# EAGLE design main (EAGLE 6.4)
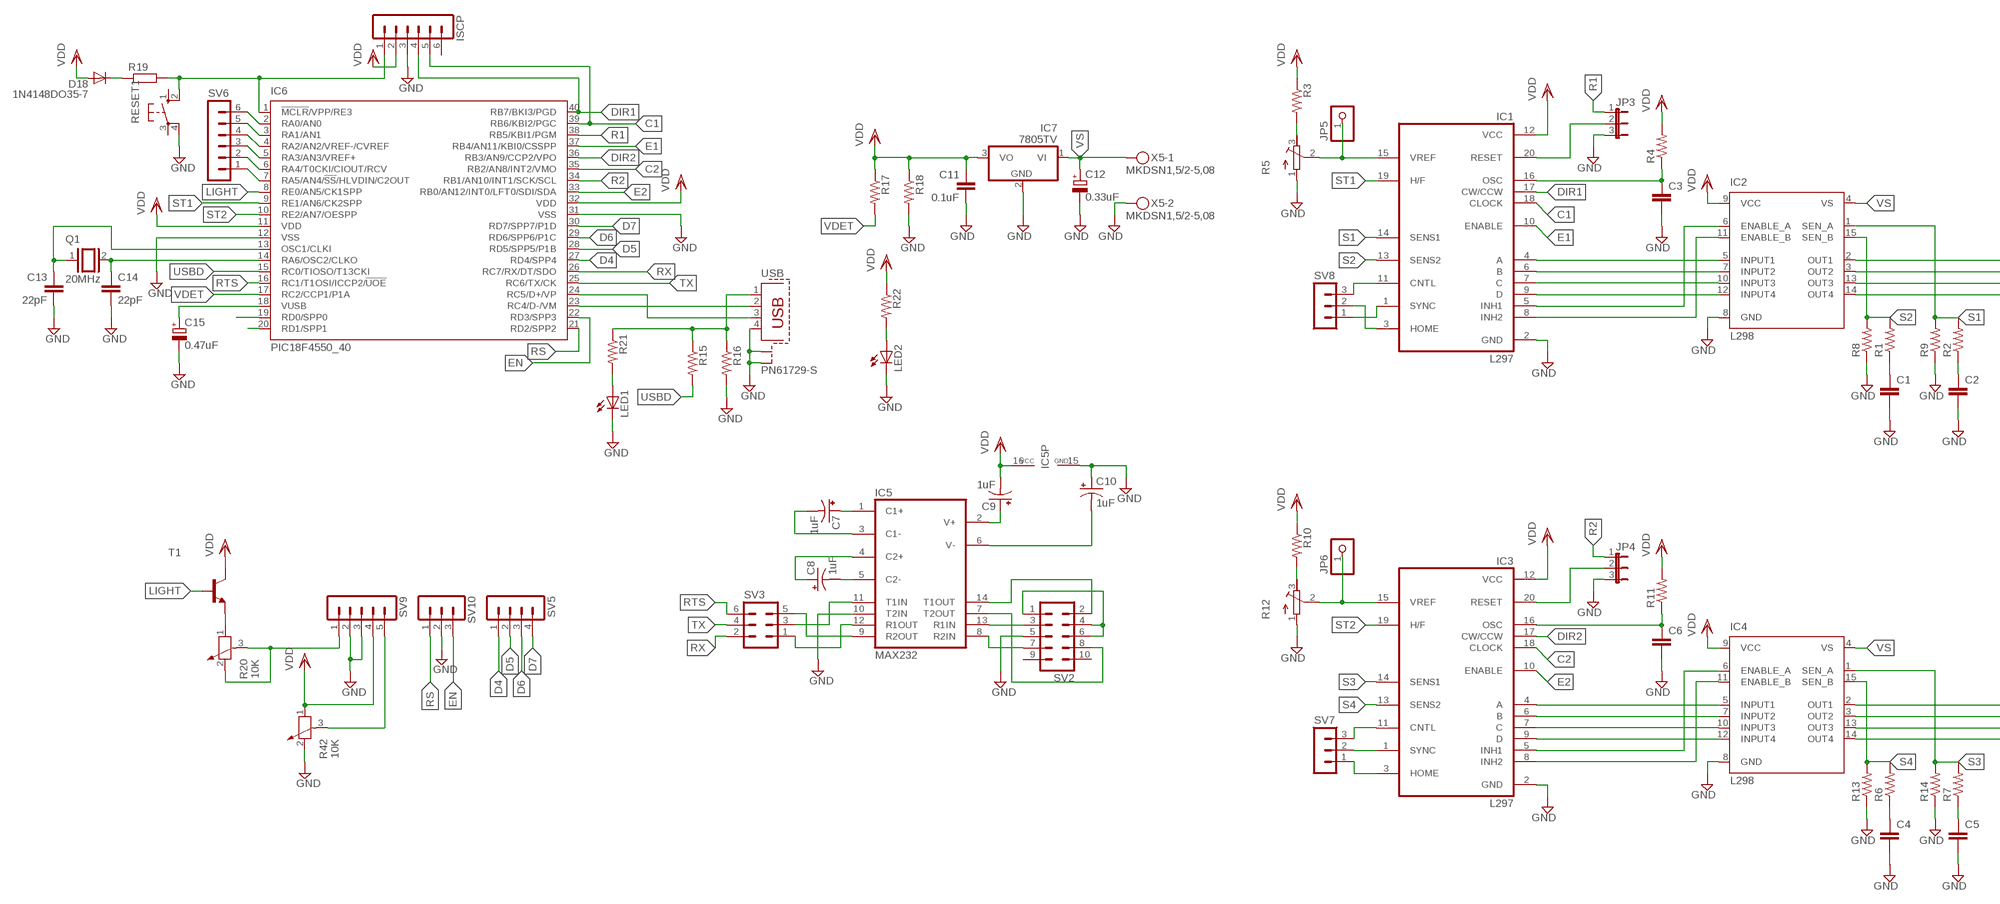
[diagram p0: schematic, sheet 1, part 1 of 2]
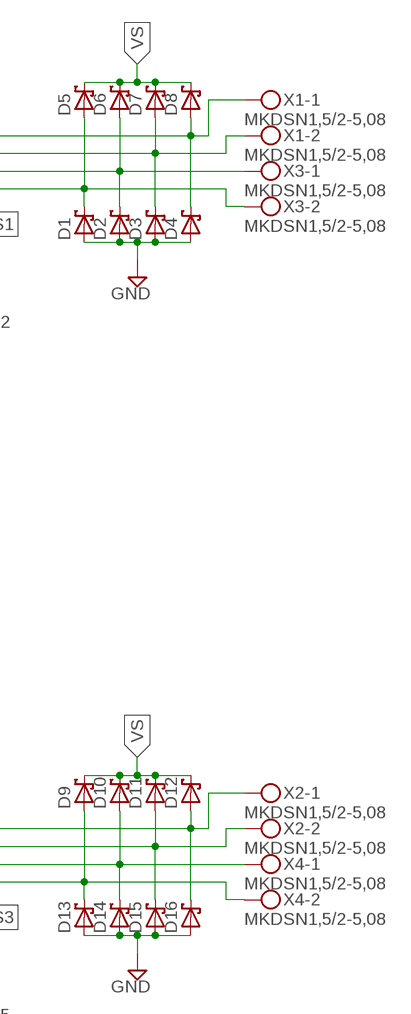
[diagram p1: schematic, sheet 1, part 2 of 2]

## Parts
C1  C2.5/2  [C2.5-2]
C2  C2.5/2  [C2.5-2]
C3  C2.5/2  [C2.5-2]
C4  C2.5/2  [C2.5-2]
C5  C2.5/2  [C2.5-2]
C6  C2.5/2  [C2.5-2]
C7  1uF  CPOL-USE2.5-6  [E2,5-6]
C8  1uF  CPOL-USE2.5-6  [E2,5-6]
C9  1uF  CPOL-USE2.5-6  [E2,5-6]
C10  1uF  CPOL-USE2.5-6  [E2,5-6]
C11  0.1uF  C-EU025-025X050  [C025-025X050]
C12  0.33uF  CPOL-EUE2.5-6  [E2,5-6]
C13  22pF  C-EU025-024X044  [C025-024X044]
C14  22pF  C-EU025-024X044  [C025-024X044]
C15  0.47uF  CPOL-EUE2.5-6  [E2,5-6]
D1  SCHOTTKY-DIODEDO201T15  [DO201T15]
D2  SCHOTTKY-DIODEDO201T15  [DO201T15]
D3  SCHOTTKY-DIODEDO201T15  [DO201T15]
D4  SCHOTTKY-DIODEDO201T15  [DO201T15]
D5  SCHOTTKY-DIODEDO201T15  [DO201T15]
D6  SCHOTTKY-DIODEDO201T15  [DO201T15]
D7  SCHOTTKY-DIODEDO201T15  [DO201T15]
D8  SCHOTTKY-DIODEDO201T15  [DO201T15]
D9  SCHOTTKY-DIODEDO201T15  [DO201T15]
D10  SCHOTTKY-DIODEDO201T15  [DO201T15]
D11  SCHOTTKY-DIODEDO201T15  [DO201T15]
D12  SCHOTTKY-DIODEDO201T15  [DO201T15]
D13  SCHOTTKY-DIODEDO201T15  [DO201T15]
D14  SCHOTTKY-DIODEDO201T15  [DO201T15]
D15  SCHOTTKY-DIODEDO201T15  [DO201T15]
D16  SCHOTTKY-DIODEDO201T15  [DO201T15]
D18  1N4148DO35-7  [DO35-7]
IC1  L297  [DIL20]
IC2  L298  [MULTIWATT-15]
IC3  L297  [DIL20]
IC4  L298  [MULTIWATT-15]
IC5  MAX232  [DIL16]
IC6  PIC18F4550_40  [DIL40]
IC7  7805TV  [TO220V]
ISCP  MA06-1  [MA06-1]
JP3  JP2E  [JP2]
JP4  JP2E  [JP2]
JP5  PINHD-1X1  [1X01]
JP6  PINHD-1X1  [1X01]
LED1  LED5MM  [LED5MM]
LED2  LED5MM  [LED5MM]
Q1  20MHz  XTAL/S  [QS]
R1  R-US_0204/7  [0204/7]
R2  R-US_0204/7  [0204/7]
R3  R-US_0204/7  [0204/7]
R4  R-US_0204/7  [0204/7]
R5  R-TRIMM64Y  [RTRIM64Y]
R6  R-US_0204/7  [0204/7]
R7  R-US_0204/7  [0204/7]
R8  R-US_0411/15  [0411/15]
R9  R-US_0411/15  [0411/15]
R10  R-US_0204/7  [0204/7]
R11  R-US_0204/7  [0204/7]
R12  R-TRIMM64Y  [RTRIM64Y]
R13  R-US_0411/15  [0411/15]
R14  R-US_0411/15  [0411/15]
R15  R-US_0204/7  [0204/7]
R16  R-US_0204/7  [0204/7]
R17  R-US_0204/7  [0204/7]
R18  R-US_0204/7  [0204/7]
R19  R-EU_0204/7  [0204/7]
R20  10K  POTENTIOMETER_PT-10  [PT-10]
R21  R-US_0204/7  [0204/7]
R22  R-US_0204/7  [0204/7]
R42  10K  POTENTIOMETER_PT-10  [PT-10]
RESET1  10-XX  [B3F-10XX]
SV2  MA05-2  [MA05-2]
SV3  MA03-2  [MA03-2]
SV5  MA04-1  [MA04-1]
SV6  MA06-1  [MA06-1]
SV7  MA03-1  [MA03-1]
SV8  MA03-1  [MA03-1]
SV9  MA05-1  [MA05-1]
SV10  MA03-1  [MA03-1]
T1  BC548-NPN-TO92-CBE  [TO92-CBE]
USB  PN61729-S  [PN61729-S]
X1  MKDSN1,5/2-5,08  [MKDSN1,5/2-5,08]
X2  MKDSN1,5/2-5,08  [MKDSN1,5/2-5,08]
X3  MKDSN1,5/2-5,08  [MKDSN1,5/2-5,08]
X4  MKDSN1,5/2-5,08  [MKDSN1,5/2-5,08]
X5  MKDSN1,5/2-5,08  [MKDSN1,5/2-5,08]

## Nets
C1: IC1.18(CLOCK) IC6.39(RB6/KBI2/PGC) ISCP.5
C2: IC3.18(CLOCK) IC6.35(RB2/AN8/INT2/VMO)
D4: IC6.27(RD4/SPP4) SV5.1
D5: IC6.28(RD5/SPP5/P1B) SV5.2
D6: IC6.29(RD6/SPP6/P1C) SV5.3
D7: IC6.30(RD7/SPP7/P1D) SV5.4
DIR1: IC1.17(CW/CCW) IC6.40(RB7/BKI3/PGD) ISCP.4
DIR2: IC3.17(CW/CCW) IC6.36(RB3/AN9/CCP2/VPO)
E1: IC1.10(ENABLE) IC6.37(RB4/AN11/KBI0/CSSPP)
E2: IC3.10(ENABLE) IC6.33(RB0/AN12/INT0/LFT0/SDI/SDA)
EN: IC6.22(RD3/SPP3) SV10.3
GND: C1.2 C2.2 C3.2 C4.2 C5.2 C6.2 C10.+ C11.2 C12.- C13.2 C14.2 C15.- D1.A D2.A D3.A D4.A D13.A D14.A D15.A D16.A IC1.2(GND) IC2.8(GND) IC3.2(GND) IC4.8(GND) IC5.10(T2IN) IC5.15(GND) IC6.12(VSS) IC6.31(VSS) IC7.2(GND) ISCP.3 JP3.3 JP4.3 LED1.K(C) LED2.K(C) R5.1(E) R8.1 R9.1 R12.1(E) R13.1 R14.1 R16.2 R18.2 R42.2 RESET1.4(P1) SV2.5 SV9.2 SV9.3 SV10.2 USB.4 USB.S1 USB.S2 X5.2
LIGHT: IC6.8(RE0/AN5/CK1SPP) T1.B
N$1: IC1.4(A) IC2.5(INPUT1)
N$2: IC1.8(INH2) IC2.11(ENABLE_B)
N$3: IC1.9(D) IC2.12(INPUT4)
N$4: IC1.7(C) IC2.10(INPUT3)
N$5: IC1.6(B) IC2.7(INPUT2)
N$6: IC1.5(INH1) IC2.6(ENABLE_A)
N$7: C1.1 R1.1
N$8: C2.1 R2.1
N$9: IC3.9(D) IC4.12(INPUT4)
N$10: IC3.7(C) IC4.10(INPUT3)
N$11: D4.C D8.A IC2.2(OUT1) X1.1
N$12: D3.C D7.A IC2.3(OUT2) X1.2
N$13: D2.C D6.A IC2.13(OUT3) X3.1
N$14: D1.C D5.A IC2.14(OUT4) X3.2
N$15: R3.2 R5.3(A)
N$16: IC5.11(T1IN) SV3.3
N$17: C3.1 IC1.16(OSC) R4.1
N$18: IC3.6(B) IC4.7(INPUT2)
N$19: IC3.4(A) IC4.5(INPUT1)
N$20: IC3.8(INH2) IC4.11(ENABLE_B)
N$21: IC3.5(INH1) IC4.6(ENABLE_A)
N$22: C4.1 R6.1
N$23: C5.1 R7.1
N$24: D12.A D16.C IC4.2(OUT1) X2.1
N$25: D11.A D15.C IC4.3(OUT2) X2.2
N$26: D10.A D14.C IC4.13(OUT3) X4.1
N$27: D9.A D13.C IC4.14(OUT4) X4.2
N$28: R10.2 R12.3(A)
N$29: IC3.15(VREF) JP6.1 R12.2(S)
N$30: C6.1 IC3.16(OSC) R11.1
N$31: IC5.13(R1IN) SV2.3
N$32: IC3.11(CNTL) SV7.3
N$33: IC5.9(R2OUT) SV3.5
N$34: IC5.12(R1OUT) SV3.1
N$35: R15.1 R16.1 R21.1 USB.1
N$36: C13.1 IC6.13(OSC1/CLKI) Q1.1
N$37: C14.1 IC6.14(RA6/OSC2/CLKO) Q1.2
N$38: IC1.20(RESET) JP3.2
N$39: IC6.1(!MCLR!/VPP/RE3) ISCP.1 R19.2 RESET1.2(S1)
N$40: D18.C R19.1
N$41: IC3.20(RESET) JP4.2
N$42: IC6.19(RD0/SPP0)
N$43: IC6.20(RD1/SPP1)
N$44: IC3.1(SYNC) SV7.2
N$45: IC3.3(HOME) SV7.1
N$46: IC1.11(CNTL) SV8.3
N$47: IC1.3(HOME) SV8.2
N$48: IC1.1(SYNC) SV8.1
N$49: IC6.2(RA0/AN0) SV6.6
N$50: R20.1 T1.E
N$51: IC6.3(RA1/AN1) SV6.5
N$52: SV2.1 SV2.4 SV2.6
N$53: R20.2 R20.3 SV9.1
N$54: IC5.14(T1OUT) SV2.2
N$55: IC5.7(T2OUT) SV2.8
N$56: IC5.8(R2IN) SV2.7
N$57: IC6.4(RA2/AN2/VREF-/CVREF) SV6.4
N$58: IC6.5(RA3/AN3/VREF+) SV6.3
N$59: IC6.6(RA4/T0CKI/CIOUT/RCV) SV6.2
N$60: IC6.7(RA5/AN4/!SS!/HLVDIN/C2OUT) SV6.1
N$61: LED1.A R21.2
N$62: LED2.A R22.2
N$68: C15.+ IC6.18(VUSB)
N$69: IC6.23(RC4/D-/VM) USB.2
N$70: IC6.24(RC5/D+/VP) USB.3
N$95: C8.- IC5.5(C2-)
N$100: IC1.15(VREF) JP5.1 R5.2(S)
N$104: C8.+ IC5.4(C2+)
N$105: C7.+ IC5.1(C1+)
N$106: C7.- IC5.3(C1-)
N$110: C9.+ IC5.2(V+)
N$111: C10.- IC5.6(V-)
N$127: R42.3 SV9.5
R1: IC6.38(RB5/KBI1/PGM) JP3.1
R2: IC6.34(RB1/AN10/INT1/SCK/SCL) JP4.1
RS: IC6.21(RD2/SPP2) SV10.1
RTS: IC6.16(RC1/T1OSI/ICCP2/!UOE) SV3.6
RX: IC6.26(RC7/RX/DT/SDO) SV3.2
S1: IC1.14(SENS1) IC2.1(SEN_A) R2.2 R9.2
S2: IC1.13(SENS2) IC2.15(SEN_B) R1.2 R8.2
S3: IC3.14(SENS1) IC4.1(SEN_A) R7.2 R14.2
S4: IC3.13(SENS2) IC4.15(SEN_B) R6.2 R13.2
ST1: IC1.19(H/F) IC6.9(RE1/AN6/CK2SPP)
ST2: IC3.19(H/F) IC6.10(RE2/AN7/OESPP)
TX: IC6.25(RC6/TX/CK) SV3.4
USBD: IC6.15(RC0/TIOSO/T13CKI) R15.2
VDD: C9.- C11.1 D18.A IC1.12(VCC) IC2.9(VCC) IC3.12(VCC) IC4.9(VCC) IC5.16(VCC) IC6.11(VDD) IC6.32(VDD) IC7.3(VO) ISCP.2 R3.1 R4.2 R10.1 R11.2 R17.1 R18.1 R22.1 R42.1 SV9.4 T1.C
VDET: IC6.17(RC2/CCP1/P1A) R17.2
VS: C12.+ D5.C D6.C D7.C D8.C D9.C D10.C D11.C D12.C IC2.4(VS) IC4.4(VS) IC7.1(VI) X5.1
Unconnected: ISCP.6 RESET1.1(S) RESET1.3(P) SV2.9 SV2.10

## Library data of the parts
C1-C6 = capacitor-wima:C: CAPACITOR naming: grid - package width
C7-C10 = rcl:CPOL-US: POLARIZED CAPACITOR, American symbol
C11 C13 C14 = rcl:C-EU: CAPACITOR, European symbol
C12 C15 = rcl:CPOL-EU: POLARIZED CAPACITOR, European symbol
D1-D16 = diode:SCHOTTKY-DIODE: Schottky Diode
D18 = diode:1N4148: DIODE high speed (Philips)
IC1 IC3 = st-microelectronics:L297: STEPPER MOTOR CONTROLLER; MPN: L297/1; OC_FARNELL: 1094209; OC_NEWARK: 56P8258
IC2 IC4 = st-microelectronics:L298: DUAL FULL-BRIDGE DRIVER; MPN: L298N; OC_FARNELL: 1589425; OC_NEWARK: 32M1527
IC5 = maxim:MAX232: RS232 TRANSEIVER; MF: MAXIM; MPN: MAX232ACPE+; OC_FARNELL: 9723773; OC_NEWARK: 68K4544
IC6 = microchip:PIC18F4*_40: USB Microcontrollers with nanoWatt Technology High-Performance, Enhanced Flash, 28/40/44-Pin, Source: http://ww1.microchip.com/downloads/en/devicedoc/39632c.pdf; MF: MICROCHIP; MPN: PIC18F4550-I/P; OC_FARNELL: 9321357; OC_NEWARK: 74K8623
IC7 = linear:78*: Positive VOLTAGE REGULATOR Source: http://cache.national.com/ds/LM/LM78L05.pdf http://www.fairchildsemi.com/ds/LM/LM7805.pdf
ISCP SV6 = con-lstb:MA06-1: PIN HEADER; OC_FARNELL: unknown; OC_NEWARK: unknown
JP3 JP4 = jumper:JP2E: JUMPER
JP5 JP6 = pinhead:PINHD-1X1: PIN HEADER
LED1 LED2 = led:LED: LED OSRAM: - CHIPLED LG R971, LG N971, LY N971, LG Q971, LY Q971, LO R971, LY R971 LH N974, LH R974 LS Q976, LO Q976, LY Q976 LO Q996 - Hyper CHIPLED LW Q18S LB Q993, LB Q99A, LB R99A - SideLED LS A670, LO A670, LY A670, LG A670, LP A670 LB A673, LV A673, LT A673, LW A673 LH A674 LY A675 LS A676, LA A676, LO A676, LY A676, LW A676 LS A679, LY A679, LG A679 - Hyper Micro SIDELED® LS Y876, LA Y876, LO Y876, LY Y876 LT Y87S - SmartLED LW L88C, LW L88S LB L89C, LB L89S, LG L890 LS L89K, LO L89K, LY L89K LS L896, LA L896, LO L896, LY L896 - TOPLED LS T670, LO T670, LY T670, LG T670, LP T670 LSG T670, LSP T670, LSY T670, LOP T670, LYG T670 LG T671, LOG T671, LSG T671 LB T673, LV T673, LT T673, LW T673 LH T674 LS T676, LA T676, LO T676, LY T676, LB T676, LH T676, LSB T676, LW T676 LB T67C, LV T67C, LT T67C, LS T67K, LO T67K, LY T67K, LW E67C LS E67B, LA E67B, LO E67B, LY E67B, LB E67C, LV E67C, LT E67C LW T67C LS T679, LY T679, LG T679 LS T770, LO T770, LY T770, LG T770, LP T770 LB T773, LV T773, LT T773, LW T773 LH T774 LS E675, LA E675, LY E675, LS T675 LS T776, LA T776, LO T776, LY T776, LB T776 LHGB T686 LT T68C, LB T68C - Hyper Mini TOPLED® LB M676 - Mini TOPLED Santana® LG M470 LS M47K, LO M47K, LY M47K Source: http://www.osram.convergy.de LUXEON: - LUMILED® LXK2-PW12-R00, LXK2-PW12-S00, LXK2-PW14-U00, LXK2-PW14-V00 LXK2-PM12-R00, LXK2-PM12-S00, LXK2-PM14-U00 LXK2-PE12-Q00, LXK2-PE12-R00, LXK2-PE12-S00, LXK2-PE14-T00, LXK2-PE14-U00 LXK2-PB12-K00, LXK2-PB12-L00, LXK2-PB12-M00, LXK2-PB14-N00, LXK2-PB14-P00, LXK2-PB14-Q00 LXK2-PR12-L00, LXK2-PR12-M00, LXK2-PR14-Q00, LXK2-PR14-R00 LXK2-PD12-Q00, LXK2-PD12-R00, LXK2-PD12-S00 LXK2-PH12-R00, LXK2-PH12-S00 LXK2-PL12-P00, LXK2-PL12-Q00, LXK2-PL12-R00 Source: www.luxeon.com KINGBRIGHT: KA-3528ASYC Source: www.kingbright.com
Q1 = special:XTAL/S: CRYSTAL
R1-R4 R6-R11 R13-R18 R21 R22 = resistor:R-US_: RESISTOR, American symbol
R5 R12 = resistor:R-TRIMM: Trimm resistor
R19 = rcl:R-EU_: RESISTOR, European symbol
R20 R42 = rcl:POTENTIOMETER_: Potentiometer
RESET1 = switch-omron:10-XX: OMRON SWITCH; MPN: B3F-1000; OC_FARNELL: 176432; OC_NEWARK: 36M3542
SV2 = con-lstb:MA05-2: PIN HEADER; OC_FARNELL: unknown; OC_NEWARK: unknown
SV3 = con-lstb:MA03-2: PIN HEADER; OC_FARNELL: unknown; OC_NEWARK: unknown
SV5 = con-lstb:MA04-1: PIN HEADER; OC_FARNELL: unknown; OC_NEWARK: unknown
SV7 SV8 SV10 = con-lstb:MA03-1: PIN HEADER; OC_FARNELL: unknown; OC_NEWARK: unknown
SV9 = con-lstb:MA05-1: PIN HEADER; OC_FARNELL: unknown; OC_NEWARK: unknown
T1 = transistor:*-NPN-: NPN Transistror BF959 corrected 2008.03.06
USB = con-berg:PN61729-S: BERG USB connector; OC_FARNELL: unknown; OC_NEWARK: unknown
X1-X5 = con-phoenix-508:MKDSN1,5/2-5,08: MKDSN 1,5/ 2-5,08 Printklemme Nennstrom: 13,5 A Nennspannung: 250 V Rastermaß: 5,08 mm Polzahl: 2 Anschlussart: Schraubanschluss Montage: Löten Anschlussrichtung Leiter/Platine: 0 ° Artikelnummer: 1729128 Source: http://eshop.phoenixcontact.com .. 1729128.pdf; MPN: MKDSN 1,5/2-5.08; OC_FARNELL: 1792903; OC_NEWARK: 30M2397

## Board
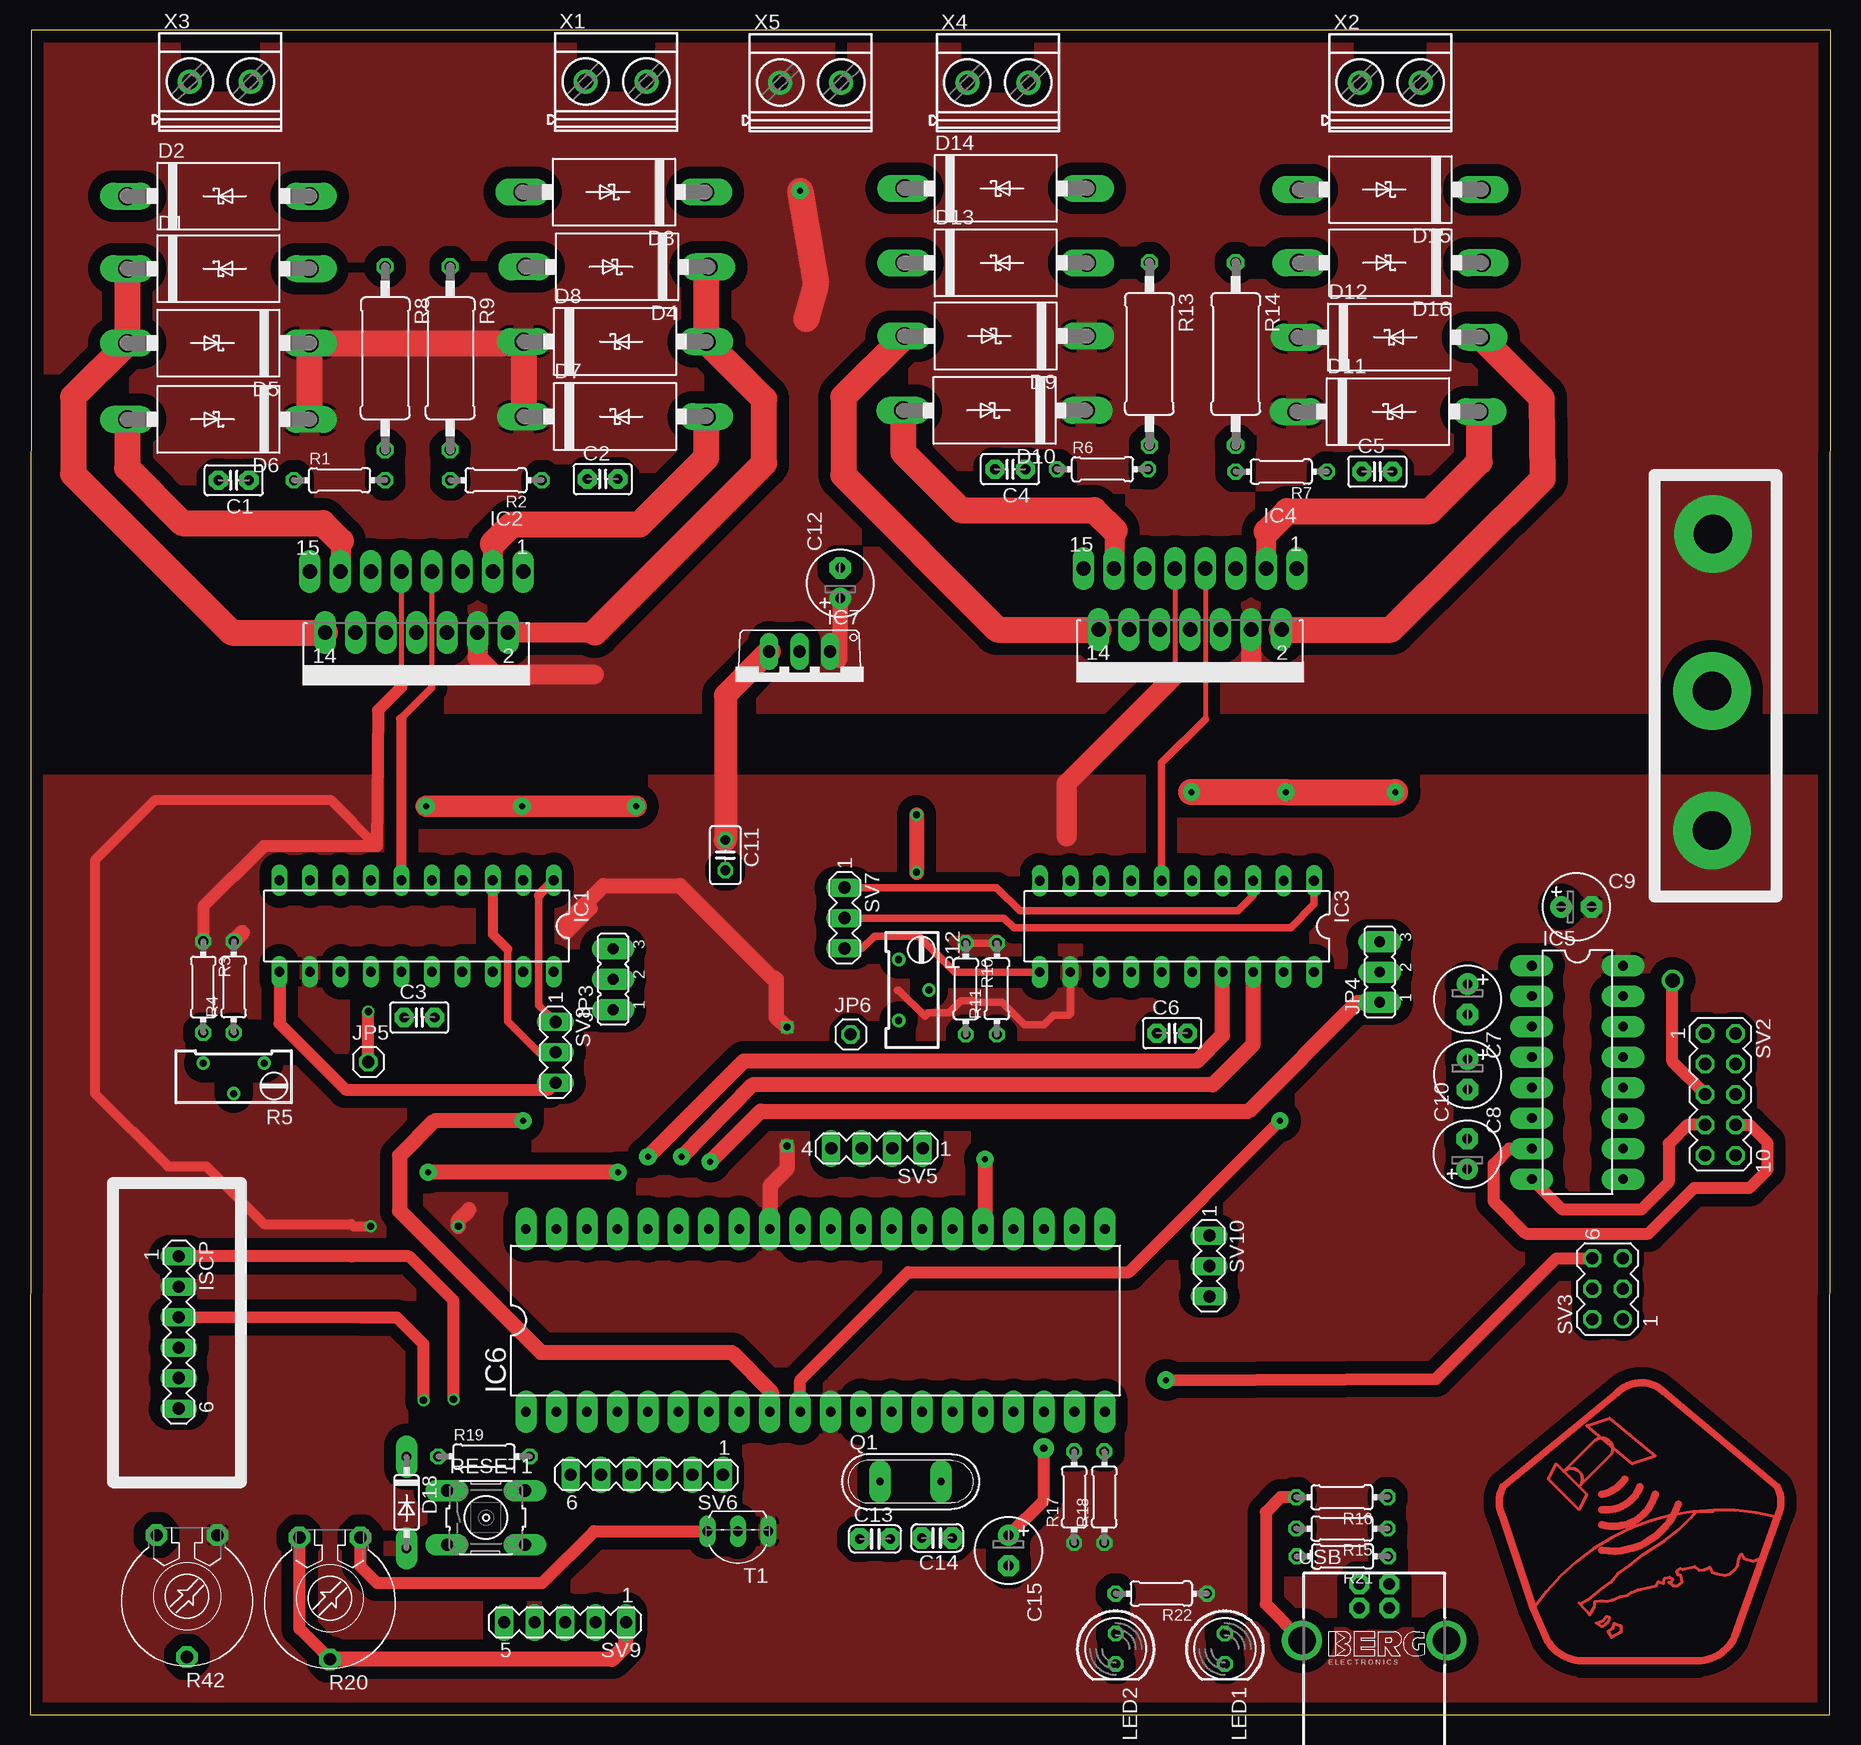
[diagram p2: board, top side]
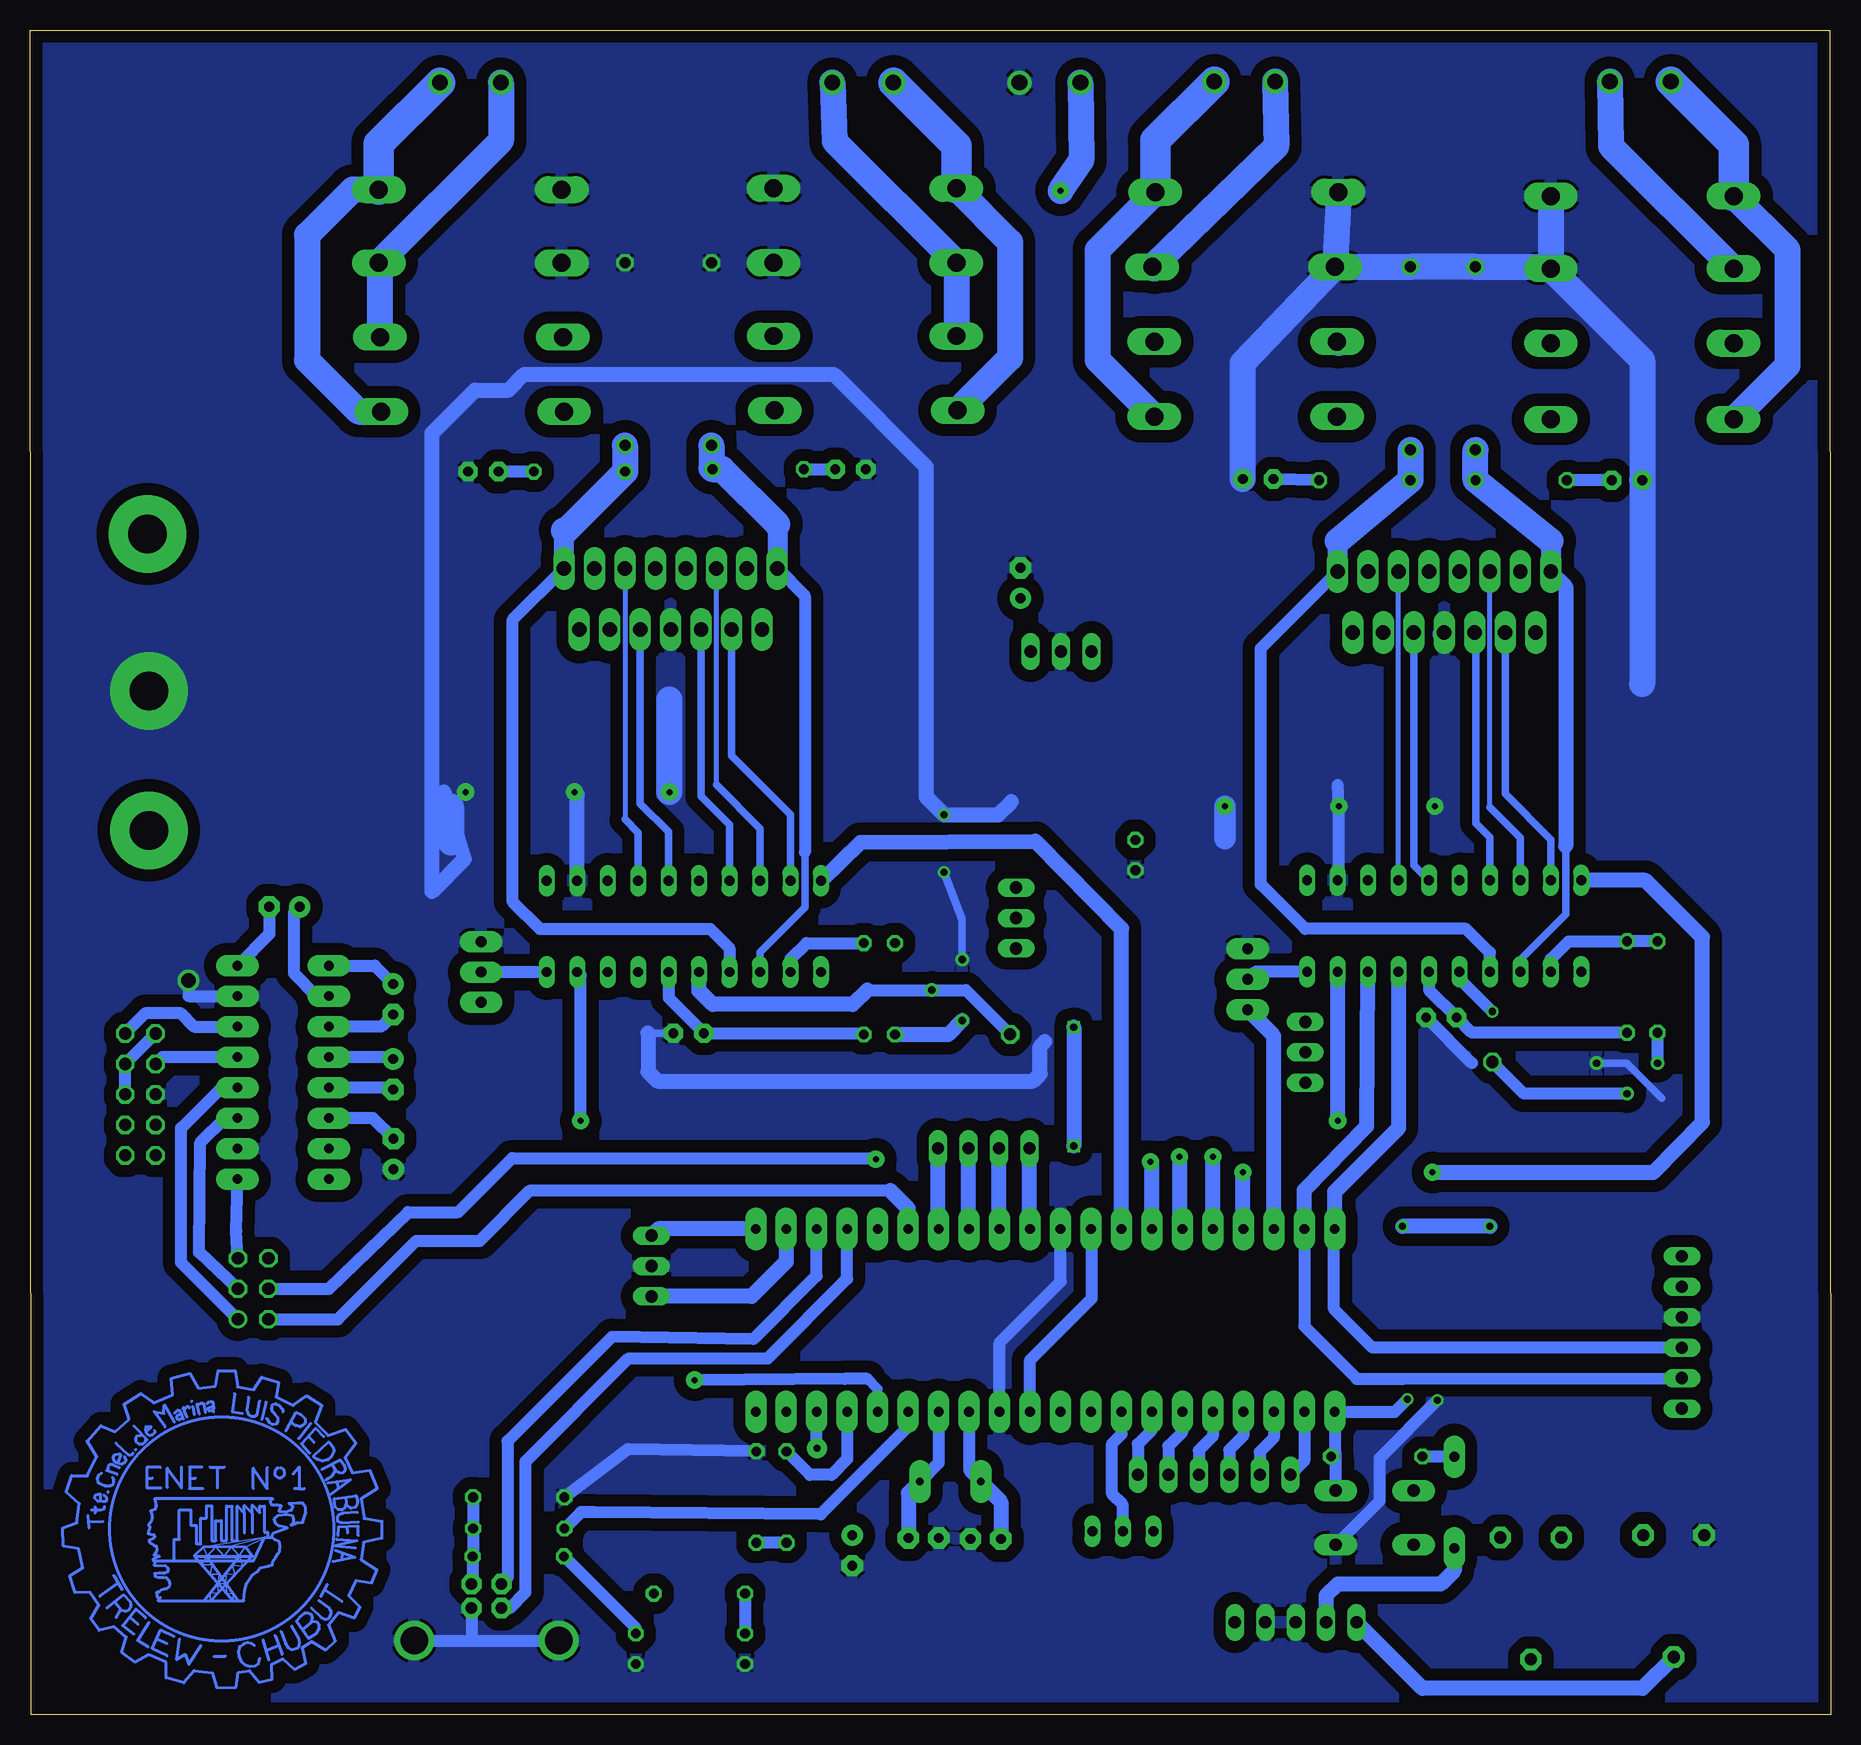
[diagram p3: board, bottom side, seen from below]

Size 150.1 x 140.4 mm. Coordinates in mm from the lower left corner, seen from the top.
Outline: 0,0 150,0 150.1,140.4 0.1,140.4 0,0
Copper layers (1*16): Top 0.035mm / dielectric 1.5mm / Bottom 0.035mm
Design rules "default *": minimum track width 10mil, minimum drill 24mil, track to track 40mil, track to pad 40mil, pad to pad 40mil, via to via 40mil, smd to smd 40mil, copper to edge 40mil, drill to drill 8mil, minimum pad ring 10mil, minimum via ring 8mil, stop-mask expansion 4mil, vias tented up to drill 0mil, thermal gap 10mil

### Footprints (pad centres in the part's own frame; a part is rotated, then mirrored left to right if it is on the bottom)
C2.5-2 = drill 0.813 pad 1.6 octagon: 1 -1.27,0; 2 1.27,0
E2,5-6 = drill 0.813 pad 1.778: + -1.27,0 | drill 0.813 pad 1.778 octagon: - 1.27,0
C025-025X050 = drill 0.813 octagon: 1 -1.27,0; 2 1.27,0
C025-024X044 = drill 0.813 pad 1.778 octagon: 1 -1.27,0; 2 1.27,0
DO201T15 = drill 1.499 long: A 7.62,0; C -7.62,0
DO35-7 = drill 0.813 pad 1.778 long: A 3.81,0; C -3.81,0
DIL20 = drill 0.813 long: 1 -11.43,-3.81; 2 -8.89,-3.81; 3 -6.35,-3.81; 4 -3.81,-3.81; 5 -1.27,-3.81; 6 1.27,-3.81; 7 3.81,-3.81; 8 6.35,-3.81; 9 8.89,-3.81; 10 11.43,-3.81; 11 11.43,3.81; 12 8.89,3.81; 13 6.35,3.81; 14 3.81,3.81; 15 1.27,3.81; 16 -1.27,3.81; 17 -3.81,3.81; 18 -6.35,3.81; 19 -8.89,3.81; 20 -11.43,3.81
MULTIWATT-15 = drill 1.2 long: 1 -8.89,-7.62; 2 -7.62,-2.54; 3 -6.35,-7.62; 4 -5.08,-2.54; 5 -3.81,-7.62; 6 -2.54,-2.54; 7 -1.27,-7.62; 8 0,-2.54; 9 1.27,-7.62; 10 2.54,-2.54; 11 3.81,-7.62; 12 5.08,-2.54; 13 6.35,-7.62; 14 7.62,-2.54; 15 8.89,-7.62
DIL16 = drill 0.813 pad 1.778 long: 1 -8.89,-3.81; 2 -6.35,-3.81; 3 -3.81,-3.81; 4 -1.27,-3.81; 5 1.27,-3.81; 6 3.81,-3.81; 7 6.35,-3.81; 8 8.89,-3.81; 9 8.89,3.81; 10 6.35,3.81; 11 3.81,3.81; 12 1.27,3.81; 13 -1.27,3.81; 14 -3.81,3.81; 15 -6.35,3.81; 16 -8.89,3.81
DIL40 = drill 0.813 pad 1.778 long: 1 -24.13,-7.62; 2 -21.59,-7.62; 3 -19.05,-7.62; 4 -16.51,-7.62; 5 -13.97,-7.62; 6 -11.43,-7.62; 7 -8.89,-7.62; 8 -6.35,-7.62; 9 -3.81,-7.62; 10 -1.27,-7.62; 11 1.27,-7.62; 12 3.81,-7.62; 13 6.35,-7.62; 14 8.89,-7.62; 15 11.43,-7.62; 16 13.97,-7.62; 17 16.51,-7.62; 18 19.05,-7.62; 19 21.59,-7.62; 20 24.13,-7.62; 21 24.13,7.62; 22 21.59,7.62; 23 19.05,7.62; 24 16.51,7.62; 25 13.97,7.62; 26 11.43,7.62; 27 8.89,7.62; 28 6.35,7.62; 29 3.81,7.62; 30 1.27,7.62; 31 -1.27,7.62; 32 -3.81,7.62; 33 -6.35,7.62; 34 -8.89,7.62; 35 -11.43,7.62; 36 -13.97,7.62; 37 -16.51,7.62; 38 -19.05,7.62; 39 -21.59,7.62; 40 -24.13,7.62
TO220V = drill 1.016 long: 1 -2.54,-2.54; 2 0,-2.54; 3 2.54,-2.54
MA06-1 = drill 1.016 long: 1 -6.35,0; 2 -3.81,0; 3 -1.27,0; 4 1.27,0; 5 3.81,0; 6 6.35,0
JP2 = drill 0.914 pad 1.778 long: 1 -2.54,0; 2 0,0; 3 2.54,0
1X01 = drill 1.016 octagon: 1 0,0
LED5MM = drill 0.813 octagon: A -1.27,0; K 1.27,0
QS = drill 0.61 pad 1.778 long: 1 -2.54,0; 2 2.54,0
0204/7 = drill 0.813 octagon: 1 -3.81,0; 2 3.81,0
RTRIM64Y = drill 0.61: 1 0,-2.54; 2 -2.54,0; 3 0,2.54
0411/15 = drill 0.914 octagon: 1 -7.62,0; 2 7.62,0
PT-10 = drill 1.016 pad 1.778 octagon: 1 -2.54,-5.08; 2 2.54,-5.08; 3 0,5.08
B3F-10XX = drill 1.016 pad 1.778 long: 1 -3.251,2.261; 2 3.251,2.261; 3 -3.251,-2.261; 4 3.251,-2.261
MA05-2 = drill 1.016 octagon: 1 -5.08,-1.27; 2 -5.08,1.27; 3 -2.54,-1.27; 4 -2.54,1.27; 5 0,-1.27; 6 0,1.27; 7 2.54,-1.27; 8 2.54,1.27; 9 5.08,-1.27; 10 5.08,1.27
MA03-2 = drill 1.016: 1 -2.54,-1.27 | drill 1.016 octagon: 2 -2.54,1.27; 3 0,-1.27; 4 0,1.27; 5 2.54,-1.27; 6 2.54,1.27
MA04-1 = drill 1.016 long: 1 -3.81,0; 2 -1.27,0; 3 1.27,0; 4 3.81,0
MA03-1 = drill 1.016 long: 1 -2.54,0; 2 0,0; 3 2.54,0
MA05-1 = drill 1.016 long: 1 -5.08,0; 2 -2.54,0; 3 0,0; 4 2.54,0; 5 5.08,0
TO92-CBE = drill 0.813 long: B 0,0; C -2.54,0; E 2.54,0
PN61729-S = drill 0.95 pad 1.676 octagon: 1 1.25,4.71; 2 -1.25,4.71; 3 -1.25,2.71; 4 1.25,2.71 | drill 2.3 pad 2.9: S1 -6.02,0; S2 6.02,0
MKDSN1,5/2-5,08 = drill 1.3 pad 2: 1 -2.561,0.025; 2 2.519,0.025

### Placement (x,y rotation side)
C1  16.98,102.88 180 top
C2  47.73,102.98 0 top
C3  32.45,58.11 0 top
C4  81.7,103.8 180 top
C5  112.3,103.6 0 top
C6  95.2,56.8 0 top
C7  119.83,59.63 270 top
C8  119.83,53.37 270 top
C9  128.89,67.33 0 top
C10  119.8,46.73 90 top
C11  57.96,71.64 270 top
C12  67.54,94.31 90 top
C13  70.44,14.66 0 top
C14  75.61,14.74 180 top
C15  81.56,13.69 270 top
D1  15.71,120.51 0 top
D2  15.71,126.56 0 top
D3  48.67,126.89 180 top
D4  48.93,120.66 180 top
D5  15.71,114.31 180 top
D6  15.71,107.96 180 top
D7  48.77,108.19 0 top
D8  48.77,114.44 0 top
D9  80.5,114.9 180 top
D10  80.4,108.7 180 top
D11  113.2,108.6 0 top
D12  113.3,114.8 0 top
D13  80.5,121 0 top
D14  80.5,127.2 0 top
D15  113.4,127.1 180 top
D16  113.4,121 180 top
D18  31.38,17.69 270 top
IC1  32.22,65.73 180 top
IC2  32.22,87.64 180 top
IC3  95.6,65.7 180 top
IC4  96.7,87.9 180 top
IC5  128.99,53.54 270 top
IC6  65.47,32.87 0 top
IC7  64.15,86.07 180 top
ISCP  12.4,31.87 270 top
JP3  48.6,61.3 90 top
JP4  112.5,61.9 90 top
JP5  28.2,54.4 0 top
JP6  68.4,56.7 0 top
LED1  99.6,5.5 270 top
LED2  90.5,5.5 270 top
Q1  73.39,19.43 0 top
R1  25.8,102.88 0 top
R2  38.84,102.88 180 top
R3  14.44,60.65 270 top
R4  16.98,60.65 90 top
R5  16.98,54.3 90 top
R6  89.4,103.8 0 top
R7  104.3,103.6 180 top
R8  29.61,113.04 270 top
R9  35.03,113.04 270 top
R10  78,60.5 270 top
R11  80.6,60.5 90 top
R12  72.4,60.4 180 top
R13  93.3,113.4 270 top
R14  100.5,113.4 270 top
R15  109.36,15.52 180 top
R16  109.36,18.13 180 top
R17  87.04,18.14 90 top
R18  89.55,18.14 90 top
R19  37.84,21.53 0 top
R20  25,9.7 180 top
R21  109.4,13.2 180 top
R22  94.3,10.1 180 top
R42  13.09,9.89 180 top
RESET1  38.01,16.43 0 top
RW  [LOGOENET]  134.2,15.2 0 top
SV2  140.9,51.7 270 top
SV3  131.5,35.5 90 top
SV5  70.6,47.2 180 top
SV6  51.4,20 180 top
SV7  67.9,66.4 270 top
SV8  43.8,55.2 270 top
SV9  44.6,7.7 180 top
SV10  98.3,37.4 270 top
T1  59,15.3 180 top
USB  112.05,6.19 0 top
X1  48.87,136.07 0 top
X2  113.4,136 0 top
X3  15.89,136.07 0 top
X4  80.7,136 0 top
X5  65.1,136 0 top

### Tracks (layer width: path | path; a pad name or v marks a point on that pad's centre or on a via)
C1
  Bottom 1.016: IC6.39 43.88,32.38 39.5,28 35.66,28 ISCP.5
  Bottom 1.27: IC6.39 43.88,43.72 38.67,49.03 IC1.18
C2  (via drill 0.5 pad 1.42)
  Top 1.27: IC3.18 101.95,55.85 98.6,52.5 60.2,52.5 v54.3,46.5
  Bottom 1.27: v54.3,46.5 54.3,40.75 IC6.35
D4
  Bottom 1.27: IC6.27 74.41,40.54 SV5.1
D5
  Bottom 1.27: IC6.28 71.87,40.54 SV5.2
D6
  Bottom 1.27: IC6.29 69.33,40.54 SV5.3
D7
  Bottom 1.27: IC6.30 66.79,40.54 SV5.4
DIR1
  Bottom 1.016: ISCP.4 38.2,30.6 41.4,33.8 41.4,40.43 IC6.40
  Bottom 1.27: IC1.17 36.03,48.9 41.34,43.59 IC6.40
DIR2  (via drill 0.5 pad 1.42)
  Top 1.27: v51.5,46.5 59.5,54.5 97.3,54.5 99.41,56.61 IC3.17
  Bottom 1.27: IC6.36 v51.5,46.5
E1  (via drill 0.5 pad 1.42)
  Top 1.27: v49,45.2 v33.2,45.2
  Bottom 1.27: IC6.37 49,40.49 v49,45.2 | v33.2,45.2 14.8,45.2 10.7,49.4 10.7,64.8 15.44,69.54 IC1.10
E2
  Bottom 1.27: IC6.33 59.12,65.52 66.3,72.8 80.88,72.7 IC3.10
EN
  Bottom 1.27: IC6.22 87.06,37.74 89.94,34.86 SV10.3
GND  (via drill 0.5 pad 1.42, 0.6, 0.6 pad 0.41, 1.2 pad 0.61, 3.2 pad 6.45)
  Top 1.016: v32.8,26.2 32.8,30.9 30.6,33.1 27.64,33.1 ISCP.3 | SV2.5 136.9,54.43 v136.9,61.2 | R16.2 104.23,18.13 103,16.9 103,9.22 USB.S1
  Top 1.27: v73.9,75 v73.9,70.2
  Top 1.778: v33,75.7 v41,75.7 v50.5,75.7
  Top 2.184: 41.01,126.85 D3.A | v96.8,76.9 v104.7,76.9 v113.8,76.9
  Bottom 0.61: R5.1 17,54.3 14.1,51.4 | C6.2 98.6,56.8 | IC3.2 104.7,69.72 | R12.1 72.4,66.3 v73.9,70.2
  Bottom 0.813: 104.7,69.72 v104.7,76.9
  Bottom 1.016: IC6.12 69.28,31.02 64.2,36.1 IC6.31 | USB.S2 113.3,6.19 | 113.3,6.19 USB.S1 | USB.4 113.3,6.19 | R18.2 100.23,22.15 R16.2 | RESET1.4 37.6,17.83 37.6,21.4 v32.8,26.2 | v136.9,61.2 136.89,59.89 IC5.15 | 29.91,54.3 C3.2 | 41.1,77.5 v41,75.7 41,69.65 IC1.2
  Bottom 1.27: 68.3,76.1 69.4,75 v73.9,75 75.4,76.5 75.4,104 83.1,111.7 108.9,111.7 110.2,110.4 113,110.4 116.6,106.8 116.6,68.6 113.9,71.3 115.6,76.9 | IC3.2 104.49,76.69 v104.7,76.9 | 98.6,56.8 98.6,53.6 97.8,52.8 66.5,52.8 65.9,53.4 65.9,55.7 65.5,56.1
  Bottom 1.778: 32.3,90.1 IC2.8 | v50.5,75.7 50.5,73
  Bottom 2.184: D3.A 41.01,126.85 D4.A | D2.A D1.A | C2.2 49,112.67 D4.A | D4.A R9.1 R8.1 23.48,120.66 D1.A | D1.A 15.71,112.89 C1.2 15.71,85.89 | v96.8,76.9 96.8,84.6 | 115,75.7 115,72.7
  other vias: 140.2,85.3
  pour Bottom: -44.2,-18.6 -47.4,158.5 237.3,156.6 237.3,-18.6
LIGHT
  Bottom 1.016: T1.B 59,17.5 59.9,18.4 59.9,22.6 59.12,23.38 IC6.8
N$1
  Bottom 0.406: IC1.4 IC2.5
N$2
  Bottom 0.406: 28.41,75.61 IC2.11
  Bottom 0.61: IC1.8 25.87,73.07 28.41,75.61
N$3
  Bottom 0.61: IC1.9 23.33,72.93 27.14,76.74 IC2.12
N$4
  Bottom 0.61: IC1.7 28.41,73.11 29.6,74.3 29.6,90.1 IC2.10
N$5
  Top 0.406: IC2.7 33.49,85.59
  Top 0.61: 33.49,85.59 30.9,83
  Top 0.813: 30.9,83 30.95,82.95 IC1.6
  Bottom 0.61: 31,69.59 IC1.6
N$6
  Bottom 0.61: IC2.6 34.76,70.81 IC1.5
N$7
  Bottom 1.016: C1.1 R1.1
N$8
  Bottom 1.016: R2.1 C2.1
N$9
  Bottom 0.61: IC4.12 91.62,79.92 86.71,75.01 IC3.9
N$10
  Bottom 0.61: IC3.7 91.79,74.19 94.16,76.56 IC4.10
N$11
  Top 1.676: 47.08,90.18 IC2.2
  Top 2.184: 47.08,90.18 61.2,104.3 61.2,109.63 D8.A 56.39,120.52 D4.C
  Bottom 2.184: X1.1 46.21,130.7 D4.C 56.39,120.52
N$12
  Top 1.676: 38.57,97.57 IC2.3
  Top 2.184: 38.57,97.57 40.2,99.2 50.8,99.2 56.39,104.79 D7.A
  Bottom 2.184: D7.A 61.1,112.9 61.1,122.08 D3.C
  Bottom 2.54: X1.2 56.29,131.19 D3.C
N$13
  Top 1.676: 25.9,97.8 25.9,95.29 IC2.13
  Top 2.184: D6.A 8.09,103.91 12.7,99.3 24.4,99.3 25.9,97.8
  Bottom 2.184: D6.A 3.6,112.45 3.6,122.07 D2.C
  Bottom 2.54: X3.1 8.09,130.86 D2.C
N$14
  Top 2.184: D1.C D5.A 3.6,109.82 3.6,103.4 16.82,90.18 IC2.14
  Bottom 2.184: X3.2 18.31,130.73 D1.C
N$15
  Bottom 1.016: R3.2 R5.3
N$16
  Bottom 1.016: SV3.3 136,38.53 135.9,47.7 133.87,49.73 IC5.11
N$17
  Bottom 1.016: R4.1 29.91,56.84 C3.1 33.49,60.42 IC1.16
N$18
  Top 0.406: IC4.7 97.97,82.97
  Top 0.61: IC3.6 94.33,76.9 94.33,77.53 94.33,79.33 97.97,82.97
N$19
  Bottom 0.406: IC4.5 100.51,74.61
  Bottom 0.61: 100.51,74.61 99.41,73.51 IC3.4
N$20
  Bottom 0.406: 92.89,77.49 IC4.11
  Bottom 0.61: IC3.8 89.25,73.85 92.89,77.49
N$21
  Bottom 0.61: IC3.5 96.87,73.57 99.24,75.94 IC4.6
N$22
  Bottom 1.016: R6.1 C4.1
N$23
  Bottom 1.016: R7.1 C5.1
N$24
  Top 2.184: IC4.2 113.44,90.44 126.1,103 126,109.72 D12.A
  Bottom 2.184: X2.1 110.84,131.18 D16.C 120.92,120.9 D12.A
N$25
  Top 1.676: IC4.3 103.05,98.55 103.1,98.6
  Top 2.184: 103.1,98.6 104.8,100.3 116.7,100.3 120.82,104.42 D11.A
  Bottom 2.184: D15.C 123.2,127.1 127,123.3 127,112.9 122.7,108.6 D11.A
  Bottom 2.54: X2.2 121.02,130.92 D15.C
N$26
  Top 1.676: 90.4,98.7 90.4,95.57 IC4.13
  Top 2.184: D10.A 72.78,105.22 77.6,100.4 88.7,100.4 90.4,98.7
  Bottom 2.184: D14.C 68.4,122.72 68.4,113.08 D10.A
  Bottom 2.54: X4.1 72.88,130.77 D14.C
N$27
  Top 2.184: D9.A 67.8,109.82 67.8,103.3 80.66,90.44 IC4.14
  Bottom 2.184: X4.2 83.02,131.14 D13.C D9.A
N$28
  Bottom 1.016: R10.2 77.96,56.65
  Bottom 1.27: R12.3 73.57,56.69 R10.2
N$29
  Bottom 1.016: 80.3,60.4 R12.2 72.1,60.4 JP6.1
  Bottom 1.27: 80.3,60.4 81.5,59.2 93.2,59.2 94.33,60.33 IC3.15
N$30
  Bottom 1.016: IC3.16 96.87,59.74 C6.1 80.71,56.8 R11.1
N$31
  Bottom 1.016: IC5.13 139.06,54.81 SV2.3
N$32
  Top 0.61: SV7.3 69.36,63.86 70.4,64.9 74.1,64.9 77.1,61.9 IC3.11
N$33
  Bottom 1.016: SV3.5 132.9,40.31 IC5.9
N$34
  Bottom 1.016: SV3.1 137.5,37.69 137.5,48.9 134.13,52.27 IC5.12
N$35
  Bottom 1.016: R16.1 R15.1 113.17,13.24 R21.1 113.21,10.99 USB.1
N$36
  Bottom 1.016: IC6.13 71.82,20.4 Q1.1
  Bottom 1.27: Q1.1 69.17,17.75 C13.1
N$37
  Bottom 1.016: IC6.14 74.36,21 Q1.2
  Bottom 1.27: Q1.2 76.88,18.48 C14.1
N$38
  Bottom 1.016: IC1.20 47.98,61.92 JP3.2
N$39  (via drill 0.6 pad 0.41)
  Top 1.016: v35.3,26.3 35.3,34.5 31.6,38.2 26.82,38.2 ISCP.1
  Bottom 1.016: R19.2 41.26,21.14 RESET1.2 41.29,18.66 IC6.1 36.35,25.25 v35.3,26.3
N$40
  Bottom 1.016: R19.1 31.41,21.53 D18.C
N$41
  Bottom 1.016: IC3.20 JP4.2
N$44
  Top 0.61: IC3.1 107.03,67.53 105.1,65.6 82,65.6 81.2,66.4 SV7.2
N$45
  Top 0.61: SV7.1 80.56,68.94 82.5,67 100.7,67 101.95,68.25 IC3.3
N$46
  Top 1.016: IC1.11 20.8,57.6 26.3,52.1 43.24,52.1 SV8.3
N$47
  Top 0.61: 39.8,63.8 39.8,57.8 42.4,55.2 SV8.2
  Top 0.813: IC1.3 38.57,65.03 39.8,63.8
N$48
  Top 0.61: 42.4,68.29 42.4,59.14 SV8.1
  Top 0.813: IC1.1 42.4,68.29
N$49
  Bottom 1.016: IC6.2 43.88,21.17 SV6.6
N$50
  Top 1.016: R20.1 27.54,12.36 28.9,11 42.7,11 47,15.3 T1.E
N$51
  Bottom 1.016: IC6.3 46.42,23.08 47.59,21.91 SV6.5
N$52
  Bottom 1.016: SV2.6 SV2.4 SV2.1
N$53
  Top 1.016: R20.3 22.46,7.16 R20.2
  Top 1.27: SV9.1 49.68,5.78 48.52,4.62 R20.3
N$54
  Bottom 1.016: SV2.2 140.45,58.5 137.6,58.5 136.45,57.35 IC5.14
N$55
  Top 1.016: IC5.7 123.29,47.19 122,45.9 122,42.8 124.7,40.1 134.9,40.1 138.7,43.9 143.3,43.9 144.8,45.4 144.8,47.7 143.34,49.16 SV2.8
N$56
  Top 1.016: SV2.7 138.16,49.16 136.6,47.6 136.6,44.4 134.3,42.1 127.73,42.1 IC5.8
N$57
  Bottom 1.016: IC6.4 48.96,23.24 50.13,22.07 SV6.4
N$58
  Bottom 1.016: IC6.5 51.5,23.2 52.67,22.03 SV6.3
N$59
  Bottom 1.016: IC6.6 54.04,23.56 55.21,22.39 SV6.2
N$60
  Bottom 1.016: IC6.7 56.58,23.72 57.75,22.55 SV6.1
N$61
  Bottom 1.016: LED1.A 99.6,7.21 R21.2
N$62
  Bottom 1.016: R22.2 LED2.A
N$68  (via drill 0.6 pad 1.68)
  Top 1.016: C15.+ 84.5,17.9 v84.5,22.2
  Bottom 1.016: v84.5,22.2 84.52,22.22 IC6.18
N$69
  Bottom 1.016: USB.2 110.3,11.4 110.3,22.8 101.6,31.5 89.8,31.3 84.52,36.58 IC6.23
N$70
  Bottom 1.016: USB.3 110.1,8.9 108.8,10.2 108.8,21.1 100.2,29.7 88.6,29.7 81.98,36.32 IC6.24 82,40.47
N$95
  Bottom 1.016: C8.- 120,52.27 IC5.5
N$100  (via drill 0.6)
  Top 1.016: JP5.1 v28.2,58.6
  Bottom 1.016: R5.2 25.56,51.76 JP5.1 | v28.2,58.6 30.95,61.35 IC1.15
N$104
  Bottom 1.016: C8.+ 120,54.81 IC5.4
N$105
  Bottom 1.016: IC5.1 121.36,62.43 C7.+
N$106
  Bottom 1.016: C7.- 120.84,57.35 IC5.3
N$110
  Bottom 1.016: IC5.2 126.19,59.89 128.1,61.8 128.1,66.85 C9.+
N$111
  Bottom 1.016: C10.- 121.53,49.73 IC5.6
N$127
  Bottom 1.27: R42.3 15.7,2.2 34.02,2.2 SV9.5
R1
  Bottom 1.27: IC6.38 46.42,56.58 JP3.1
R2  (via drill 0.5 pad 1.42)
  Top 1.27: v56.7,46.1 60.9,50.3 101.6,50.3 110.66,59.36 JP4.1
  Bottom 1.27: IC6.34 56.58,45.98 v56.7,46.1
RS
  Bottom 1.27: IC6.21 97.75,40.49 SV10.1
RTS  (via drill 0.5 pad 1.42)
  Top 1.016: v94.7,27.9 117.2,28 127.24,38.04 SV3.6
  Bottom 0.813: IC6.16 79.44,27.14 80.3,28
  Bottom 1.016: v94.7,27.9 82.19,28 80.3,28
RX
  Bottom 1.016: 78.4,43.7 108.4,43.7 112.6,39.5 117.9,39.5 124.44,32.96 SV3.2
  Bottom 1.27: IC6.26 76.9,42.2 78.4,43.7
S1
  Bottom 1.016: IC1.14 28.41,63.51 30.4,65.5 43.8,65.5 47.5,69.2 47.5,88.87 IC2.1
  Bottom 1.676: 41.11,97.8 IC2.1
  Bottom 2.184: R9.2 R2.2 41.11,97.8
S2
  Bottom 0.61: 22.1,72.4 22.1,66.7 25.87,62.93 IC1.13
  Bottom 1.27: IC2.15 22.1,94.03 22.1,72.4
  Bottom 1.676: 23.33,97.8 IC2.15
  Bottom 2.184: 23.33,97.8 R1.2 R8.2
S3
  Bottom 1.016: IC4.1 109.9,91.21 109.9,67.8 107.6,65.5 93.4,65.5 91.79,63.89 IC3.14
  Bottom 1.676: IC4.1 105.59,98.69 105.6,98.7
  Bottom 2.184: 105.6,98.7 105.39,98.7 R7.2 R14.2
S4
  Bottom 0.61: 85.5,71.9 85.5,67.3 89.25,63.55 IC3.13
  Bottom 1.016: IC4.15 85.5,93.23 85.5,71.9
  Bottom 1.676: 87.8,99.2 IC4.15
  Bottom 2.184: R13.2 93.3,103.89 R6.2 92.4,103.8 87.8,99.2
ST1  (via drill 0.5 pad 1.42)
  Top 1.27: v41.1,49.5 33.7,49.5 30.8,46.6 30.8,42 42.6,30.2 58.5,30.2 61.8,26.9 61.8,25.39 IC6.9
  Bottom 1.27: IC1.19 v41.11,49.51 v41.1,49.5
ST2  (via drill 0.5 pad 1.42)
  Top 1.016: IC6.10 64.2,27.9 73.2,36.9 91.6,36.9 v104.2,49.5
  Bottom 1.016: v104.2,49.5 104.2,61.6 IC3.19
TX  (via drill 0.5 pad 1.42)
  Top 1.27: v79.6,46.3 79.6,40.65 IC6.25
  Bottom 1.016: SV3.4 125.2,35.5 118.6,41.9 114.4,41.9 109.9,46.4 79.7,46.4
  Bottom 1.27: 79.7,46.4 v79.6,46.3
USBD
  Bottom 1.016: IC6.15 76.9,24 84.2,16.7 103.07,16.9 104.17,16.9 R15.2
VDD  (via drill 0.6, 3.2 pad 6.45)
  Top 0.406: IC2.9 30.95,85.65 | IC4.9 95.43,86.63
  Top 0.61: 72.3,60.4 72.4,60.4 74.6,58.2 74.9,58.5 76.6,58.5 77.6,59.5 78.7,59.5 78.8,59.4 81,59.4 82.9,57.5 84.5,57.5 85.3,58.3 86.6,58.3 86.71,58.41 IC3.12 | R10.1 80.7,64.3
  Top 0.813: 28.9,72.4 25.1,76.2 10.4,76.2 5.4,71.2 5.4,51.8 11.5,45.7 14.7,45.7 19.5,40.9 26.8,40.9 27,40.7 v28.4,40.7
  Top 1.016: 30.95,85.65 29,83.7 28.9,72.4 19.5,72.4 14.44,67.34 R3.1
  Top 1.27: 46.71,67.21 44.7,65.2 44.7,66 47.8,69.1 54.2,69.1 61.9,61.4 62.1,61.4 62.2,61.3 62.2,58.1 v63.1,57.3 | 17.72,65.2 R4.2 | v35.7,40.7 35.7,41.2 36.6,42.1 | v63.1,47.4 63.1,45.5 61.7,44.1 61.7,40.53 IC6.32
  Top 1.676: 95.43,86.63 86.4,77.6 86.4,73.2
  Top 1.93: IC7.3 57.96,84.96 C11.1
  Bottom 1.016: C9.- 130.16,65.07 IC5.16 | IC6.11 66.74,29.56 61.6,34.7 61.6,40.43 IC6.32 | R3.1 R4.2 21.84,64.46 23.33,62.97 IC1.12 | R17.1 R18.1 | IC3.12 86.71,62.99 85.39,64.31 R11.2
  Bottom 1.27: v28.4,40.7 v35.7,40.7 | v63.1,57.3 v63.1,47.4 | D18.A 31.38,12.02 32.5,10.9 41.1,10.9 42.06,9.94 SV9.4
  other vias: 140.2,73.7
  pour Top: -0.4,77.7 -0.2,-7.9 149.9,-9.8 149.4,77.7
VDET
  Bottom 1.016: 86.98,22.01 R17.2 85.09,20 83.3,20 81.98,21.32 IC6.17
VS  (via drill 0.5 pad 1.42, 3.2 pad 6.45)
  Top 1.27: C12.+ 67.46,87.84 IC7.1
  Top 1.676: IC2.4 37.3,88.1 38.7,86.7 47,86.7 | IC4.4 101.78,86.92 101.8,86.9
  Top 2.184: D6.C D5.C 41.02,114.31 D8.C D7.C | v64.2,127 65.5,119.2 64.7,116.3
  Bottom 2.184: 41.02,114.31 D8.C | X5.1 62.46,129.54 v64.2,127
  other vias: 140.3,98.4
  pour Top: -11.5,84.2 -10.6,138.3 154.3,143.4 161.6,84.2